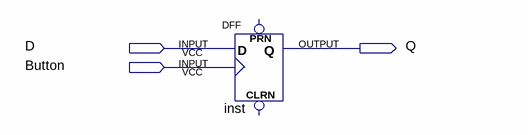
[diagram p0: schematic sheet]
// Quartus schematic 31.bdf as structural Verilog: 1 symbols, 3 pins
module \31  (
  input  D,
  input  Button,
  output Q
);

  DFF inst (.CLK(Button), .D(D), .Q(Q));  // open: CLRN, PRN
endmodule
